# EAGLE design DmxAnalogLed (EAGLE 6.4)
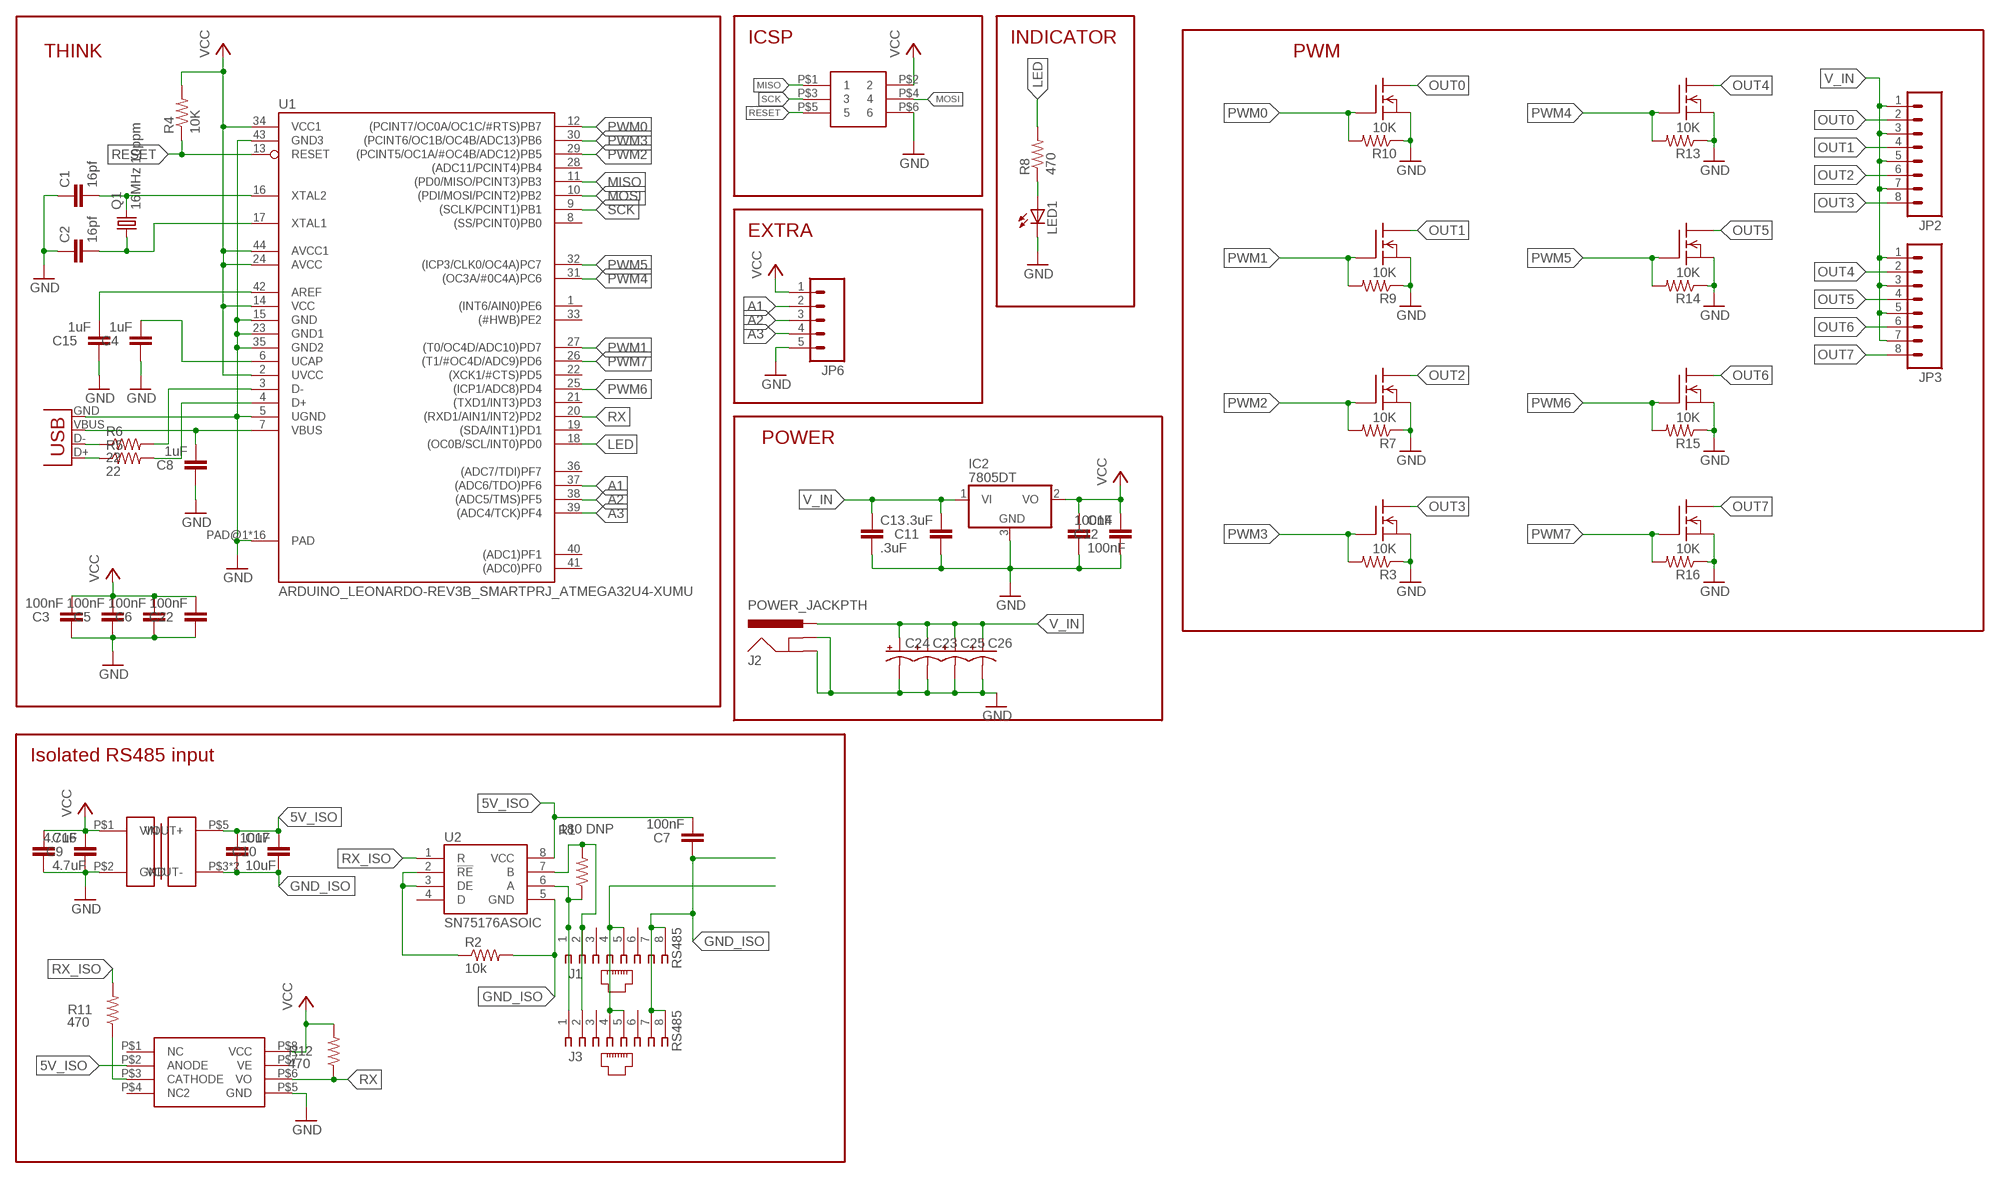
[diagram p0: schematic, sheet 1]

## Parts
C1  16pf  CAP0805  [0805]
C2  16pf  CAP0805  [0805]
C3  100nF  CAP0805  [0805]
C4  1uF  CAP0805  [0805]
C5  100nF  CAP0805  [0805]
C6  100nF  CAP0805  [0805]
C7  100nF  CAP0805  [0805]
C8  1uF  CAP0805  [0805]
C9  4.7uF  CAP0805  [0805]
C10  10uF  CAP0805  [0805]
C11  .3uF  CAP0805  [0805]
C12  100nF  CAP0805  [0805]
C13  .3uF  CAP1210  [1210]
C14  100nF  CAP1210  [1210]
C15  1uF  CAP0805  [0805]
C16  4.7uF  CAP1210  [1210]
C17  10uF  CAP1210  [1210]
C22  100nF  CAP0805  [0805]
C23  CAP_POLE  [PANASONIC_E]
C24  CAP_POLE  [PANASONIC_E]
C25  CAP_POLE  [PANASONIC_E]
C26  CAP_POLE  [PANASONIC_E]
IC2  7805DT  [TO252]
J1  RS485  520426-4  [520426-4]
J2  POWER_JACKPTH  [POWER_JACK_PTH]
J3  RS485  520426-4  [520426-4]
JP2  M083.5MM-8  [SCREWTERMINAL-3.5MM-8]
JP3  M083.5MM-8  [SCREWTERMINAL-3.5MM-8]
JP6  M05PTH  [1X05]
LED1  LED5MM  [LED5MM]
Q1  16MHz 10ppm  CRYSTAL  [XS3225]
R1  180 DNP  RESISTOR  [0805]
R2  10k  RESISTOR  [0805]
R3  10K  RESISTOR  [0805]
R4  10K  RESISTOR  [0805]
R5  22  RESISTOR  [0805]
R6  22  RESISTOR  [0805]
R7  10K  RESISTOR  [0805]
R8  470  RESISTOR  [0805]
R9  10K  RESISTOR  [0805]
R10  10K  RESISTOR  [0805]
R11  470  RESISTOR  [0805]
R12  470  RESISTOR  [0805]
R13  10K  RESISTOR  [0805]
R14  10K  RESISTOR  [0805]
R15  10K  RESISTOR  [0805]
R16  10K  RESISTOR  [0805]
U1  ARDUINO_LEONARDO-REV3B_SMARTPRJ_ATMEGA32U4-XUMU  [ARDUINO_LEONARDO-REV3B_SMARTPRJ_QFN44ML7X7]
U2  SN75176ASOIC  [SO08]
U$1  N_MOSFET  [TO252]
U$2  2X3HEADER  [2X3HEADER]
U$3  N_MOSFET  [TO252]
U$4  N_MOSFET  [TO252]
U$5  N_MOSFET  [TO252]
U$6  N_MOSFET  [TO252]
U$7  N_MOSFET  [TO252]
U$8  N_MOSFET  [TO252]
U$9  N_MOSFET  [TO252]
U$10  DC_DC_ISOLATED_0505  [IB_XLS-1W]
U$12  6N137  [8_SOIC]
X1  USBPTH  [USB-B-PTH]

## Nets
5V_ISO [power]: C7.2 C10.2 C17.1 U2.8(VCC) U$10.P$5(VOUT+) U$12.P$2(ANODE)
A1: JP6.2 U1.37((ADC6/TDO)PF6)
A2: JP6.3 U1.38((ADC5/TMS)PF5)
A3: JP6.4 U1.39((ADC4/TCK)PF4)
CONNECT_ME: R2.1 U2.2(!RE) U2.3(DE)
GND [power]: C1.1 C2.1 C3.1 C4.1 C5.1 C6.1 C8.1 C9.1 C11.1 C12.1 C13.2 C14.2 C15.1 C16.2 C22.1 C23.- C24.- C25.- C26.- IC2.3(GND) J2.GND J2.GNDBREAK JP6.5 LED1.K(C) R3.1 R7.1 R9.1 R10.1 R13.1 R14.1 R15.1 R16.1 U1.5(UGND) U1.15(GND) U1.23(GND1) U1.35(GND2) U1.43(GND3) U1.PAD@1(PAD) U1.PAD@2(PAD) U1.PAD@3(PAD) U1.PAD@4(PAD) U1.PAD@5(PAD) U1.PAD@6(PAD) U1.PAD@7(PAD) U1.PAD@8(PAD) U1.PAD@9(PAD) U1.PAD@10(PAD) U1.PAD@11(PAD) U1.PAD@12(PAD) U1.PAD@13(PAD) U1.PAD@14(PAD) U1.PAD@15(PAD) U1.PAD@16(PAD) U$1.P$2(S) U$2.P$6 U$3.P$2(S) U$4.P$2(S) U$5.P$2(S) U$6.P$2(S) U$7.P$2(S) U$8.P$2(S) U$9.P$2(S) U$10.P$2(GND) U$12.P$5(GND) X1.GND
GND_ISO [power]: C7.1 C10.1 C17.2 J1.7 J1.8 J3.7 J3.8 R2.2 U2.5(GND) U$10.P$3(VOUT-) U$10.P$4(VOUT-)
LED: R8.2 U1.18((OC0B/SCL/INT0)PD0)
MISO: U1.11((PD0/MISO/PCINT3)PB3) U$2.P$1
MOSI: U1.10((PDI/MOSI/PCINT2)PB2) U$2.P$4
N$1: R6.1 X1.D-
N$2: C1.2 Q1.P$3 U1.16(XTAL2)
N$3: R5.1 X1.D+
N$4: R5.2 U1.4(D+)
N$5: C2.2 Q1.P$1 U1.17(XTAL1)
N$6: R6.2 U1.3(D-)
N$8: LED1.A R8.1
N$9: C4.2 U1.6(UCAP)
N$10: C8.2 U1.7(VBUS) X1.VBUS
N$11: C15.2 U1.42(AREF)
N$14: R11.1 U$12.P$3(CATHODE)
OUT0: JP2.2 U$1.P$3(D)
OUT1: JP2.4 U$3.P$3(D)
OUT2: JP2.6 U$4.P$3(D)
OUT3: JP2.8 U$5.P$3(D)
OUT4: JP3.2 U$6.P$3(D)
OUT5: JP3.4 U$7.P$3(D)
OUT6: JP3.6 U$8.P$3(D)
OUT7: JP3.8 U$9.P$3(D)
PWM0: R10.2 U1.12((PCINT7/OC0A/OC1C/#RTS)PB7) U$1.P$1(G)
PWM1: R9.2 U1.27((T0/OC4D/ADC10)PD7) U$3.P$1(G)
PWM2: R7.2 U1.29((PCINT5/OC1A/#OC4B/ADC12)PB5) U$4.P$1(G)
PWM3: R3.2 U1.30((PCINT6/OC1B/OC4B/ADC13)PB6) U$5.P$1(G)
PWM4: R13.2 U1.31((OC3A/#0C4A)PC6) U$6.P$1(G)
PWM5: R14.2 U1.32((ICP3/CLK0/OC4A)PC7) U$7.P$1(G)
PWM6: R15.2 U1.25((ICP1/ADC8)PD4) U$8.P$1(G)
PWM7: R16.2 U1.26((T1/#OC4D/ADC9)PD6) U$9.P$1(G)
RESET: R4.1 U1.13(RESET) U$2.P$5
RS485A: J1.1 J3.1 R1.1 U2.6(A)
RS485B: J1.2 J3.2 R1.2 U2.7(B)
RX: R12.1 U1.20((RXD1/AIN1/INT2)PD2) U$12.P$6(VO)
RX_ISO: R11.2 U2.1(R)
SCK: U1.9((SCLK/PCINT1)PB1) U$2.P$3
V_IN [power]: C11.2 C13.1 C23.+ C24.+ C25.+ C26.+ IC2.1(VI) J2.PWR JP2.1 JP2.3 JP2.5 JP2.7 JP3.1 JP3.3 JP3.5 JP3.7
VCC: C3.2 C5.2 C6.2 C9.2 C12.2 C14.1 C16.1 C22.2 IC2.2(VO) JP6.1 R4.2 R12.2 U1.2(UVCC) U1.14(VCC) U1.24(AVCC) U1.34(VCC1) U1.44(AVCC1) U$2.P$2 U$10.P$1(VIN) U$12.P$8(VCC)
VMOT: J1.4 J1.5 J3.4 J3.5
Unconnected: J1.3 J1.6 J3.3 J3.6 U1.1((INT6/AIN0)PE6) U1.8((SS/PCINT0)PB0) U1.19((SDA/INT1)PD1) U1.21((TXD1/INT3)PD3) U1.22((XCK1/#CTS)PD5) U1.28((ADC11/PCINT4)PB4) U1.33((#HWB)PE2) U1.36((ADC7/TDI)PF7) U1.40((ADC1)PF1) U1.41((ADC0)PF0) U2.4(D) U$12.P$1(NC) U$12.P$4(NC2) U$12.P$7(VE)

## Notes on the sheet
- ICSP | INDICATOR
- THINK | PWM
- EXTRA
- POWER
- Isolated RS485 input

## Library data of the parts
C1-C17 C22 = SparkFun:CAP: Capacitor Standard 0603 ceramic capacitor, and 0.1" leaded capacitor.
C23-C26 = SparkFun:CAP_POL: Capacitor Polarized These are standard SMD and PTH capacitors. Normally 10uF, 47uF, and 100uF in electrolytic and tantalum varieties. Always verify the external diameter of the through hole cap, it varies with capacity, voltage, and manufacturer. The EIA devices should be standard.
IC2 = linear:78*: Positive VOLTAGE REGULATOR Source: http://cache.national.com/ds/LM/LM78L05.pdf http://www.fairchildsemi.com/ds/LM/LM7805.pdf
J1 J3 = con-amp:520426-4: AMP connector
J2 = SparkFun:POWER_JACK: Power Jack This is the standard 5.5mm barrel jack for power. The PTH is the most common, proven, reliable, footprint. All others are experimental. The Slot footprint only works if the mill layer is transmitted to the PCB fab house so be warned. Spark Fun Electronics SKU : PRT-00119. Mating wall wart : TOL-00298 (and others)
JP2 JP3 = SparkFun:M08: Header 8 Standard 8-pin 0.1" header. Use with straight break away headers (SKU : PRT-00116), right angle break away headers (PRT-00553), swiss pins (PRT-00743), machine pins (PRT-00117), and female headers (PRT-00115).
JP6 = SparkFun:M05: Header 5 Standard 5-pin 0.1" header. Use with straight break away headers (SKU : PRT-00116), right angle break away headers (PRT-00553), swiss pins (PRT-00743), machine pins (PRT-00117), and female headers (PRT-00115). Molex polarized connector foot print use with SKU : PRT-08230 with associated crimp pins and housings.
LED1 = SparkFun:LED: LEDs Standard schematic elements and footprints for 5mm, 3mm, 1206, and 0603 sized LEDs. 5mm - Spark Fun Electronics SKU : COM-00529 (and others)
Q1 = blinkyboard:CRYSTAL: CRYSTAL
R1-R16 = SparkFun:RESISTOR: Resistor Basic schematic elements and footprints for 0603, 1206, and PTH 1/10th watt (small) resistors.
U1 = blinkiverse:ARDUINO_LEONARDO-REV3B_SMARTPRJ_ATMEGA32U4-XU
U2 = reprap:SN75176A
U$1 U$3-U$9 = blinkiverse:N_MOSFET
U$2 = sonos_library:2X3HEADER
U$10 = blinkiverse:DC_DC_ISOLATED_0505: Galvanicly isolated 5v:5v converter. Could be a
U$12 = sonos_library:6N137
X1 = SparkFun:USB: USB Connectors USB-B-PTH is fully proven SKU : PRT-00139 USB-miniB is fully proven SKU : PRT-00587 USB-A-PCB is untested. USB-A-H is throughly reviewed, but untested. Spark Fun Electronics SKU : PRT-00437 USB-B-SMT is throughly reviewed, but untested. Needs silkscreen touching up. USB-A-S has not been used/tested USB-MB-H has not been used/tested

## Net classes
0 default: width 0.254 mm
1 power: width 0.406 mm
2 motors: width 0.61 mm

## Board
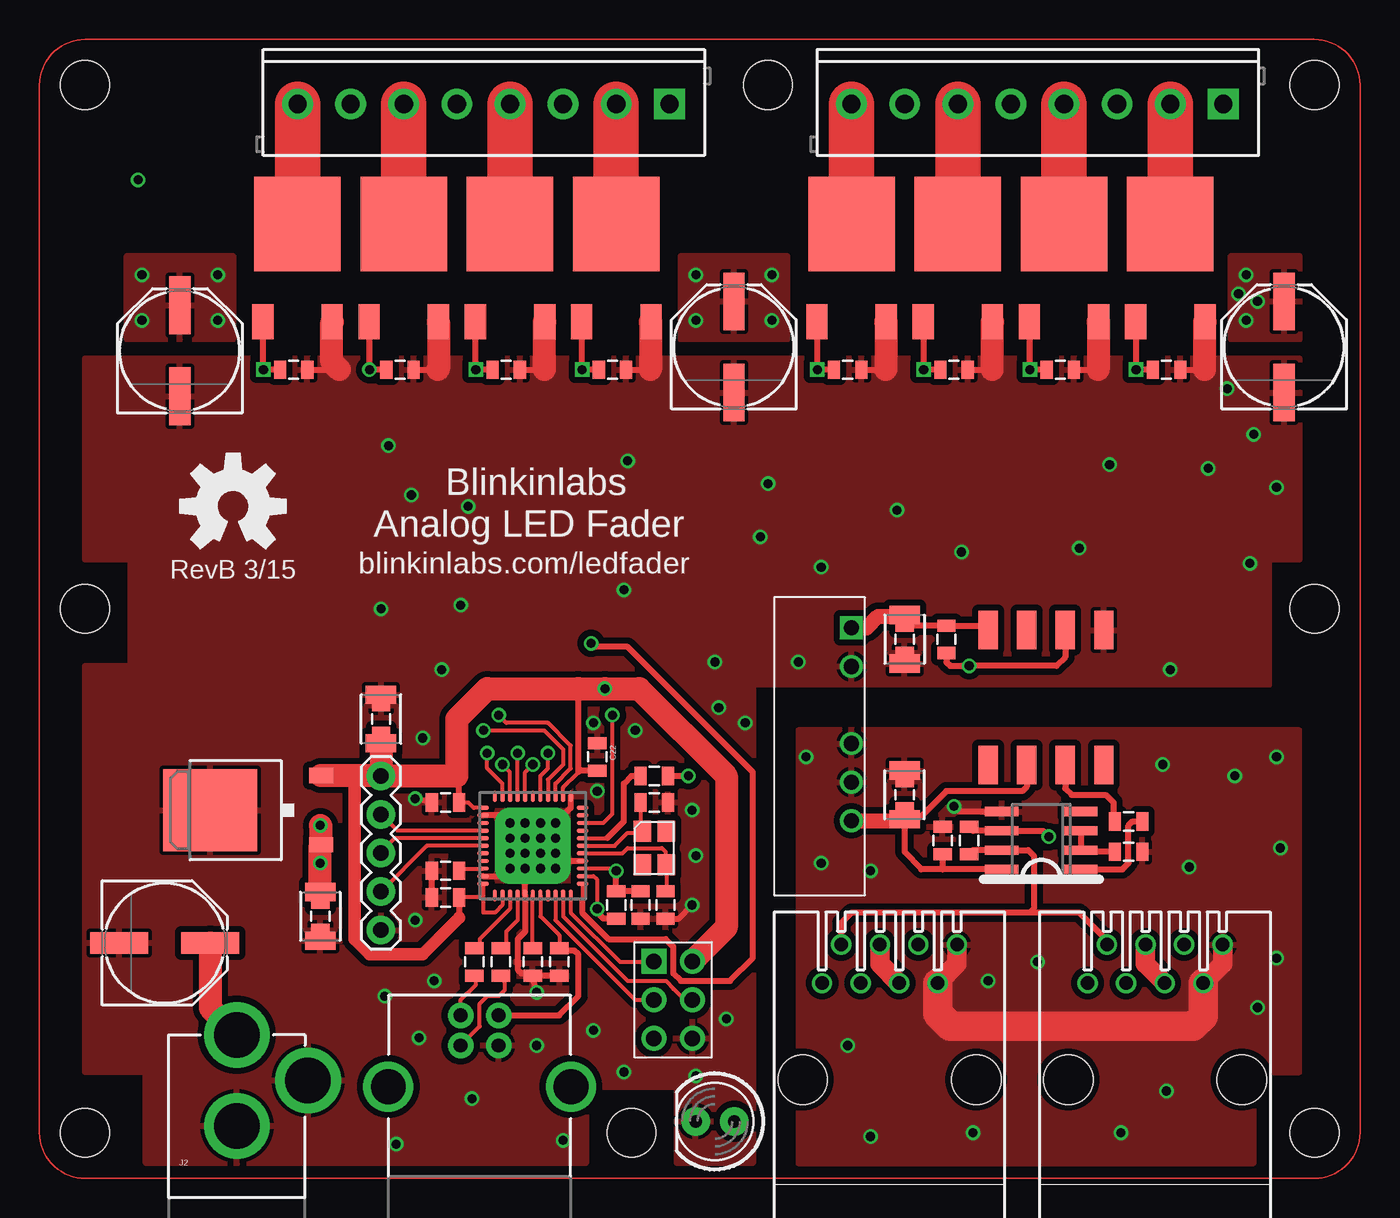
[diagram p1: board, top side]
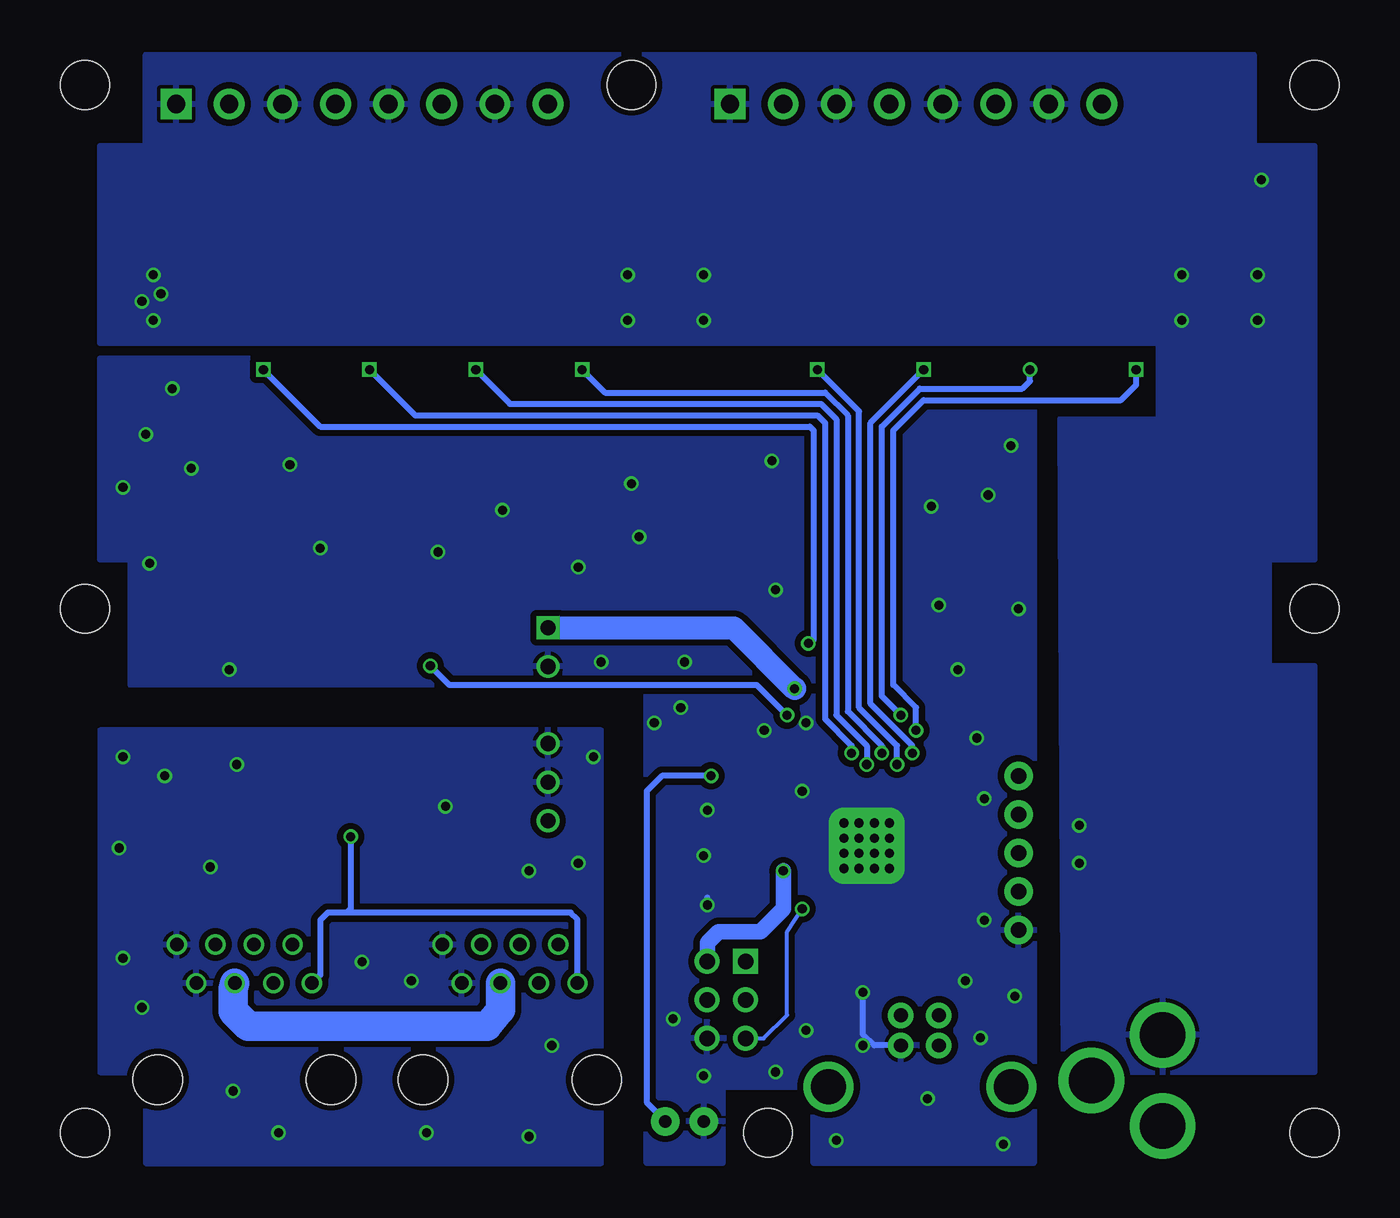
[diagram p2: board, bottom side, seen from below]

No outline drawn. Coordinates in mm, seen from the top.
Copper layers (1*16): Top 0.0356mm / dielectric 1.5011mm / Bottom 0.0356mm
Design rules "default": minimum track width 6mil, minimum drill 13mil, track to track 6mil, track to pad 6mil, pad to pad 6mil, via to via 6mil, smd to smd 6mil, copper to edge 15mil, drill to drill 6mil, minimum pad ring 7mil, minimum via ring 7mil, stop-mask expansion 4mil, vias tented up to drill 0.5mm, thermal gap 10mil
Holes 3.2 mm at 84,3 84,72 3,72 3,3 39,3 3,37.5 84,37.5 48,72

### Footprints (pad centres in the part's own frame; a part is rotated, then mirrored left to right if it is on the bottom)
0805 = smd 0.8 x 1.2: 1 -0.9,0; 2 0.9,0
1210 = smd 1.2 x 2: 1 -1.6,0; 2 1.6,0
PANASONIC_E = smd 3.8 x 1.4: + 3,0; - -3,0
TO252 = smd 1 x 1.6: 1 -2.28,-4.8; 2 2.28,-4.8 | smd 5.4 x 6.2: 3 0,2.5
520426-4 = drill 0.889: 1 -4.445,6.35; 2 -3.175,8.89; 3 -1.905,6.35; 4 -0.635,8.89; 5 0.635,6.35; 6 1.905,8.89; 7 3.175,6.35; 8 4.445,8.89 | hole 3.251: -5.715,0; 5.715,0
POWER_JACK_PTH = drill 2.997 pad 4.318: GND 0,7.7; GNDBREAK 4.7,10.7; PWR 0,13.7
SCREWTERMINAL-3.5MM-8 = drill 1.2 pad 2.032 square: 1 0,0 | drill 1.2 pad 2.032: 2 3.5,0; 3 7,0; 4 10.5,0; 5 14,0; 6 17.5,0; 7 21,0; 8 24.5,0
1X05 = drill 1.016 pad 1.88: 1 0,0; 2 2.54,0; 3 5.08,0; 4 7.62,0; 5 10.16,0
LED5MM = drill 0.813 pad 1.88: A -1.27,0; K 1.27,0
XS3225 = smd 1.4 x 1.15: P$1 -1.1,-0.8; P$2 1.1,-0.8; P$3 1.1,0.8; P$4 -1.1,0.8
ARDUINO_LEONARDO-REV3B_SMARTPRJ_QFN44ML7X7 = smd 0.75 x 0.275: 1 -3.275,2.5; 2 -3.275,2; 3 -3.275,1.5; 4 -3.275,1; 5 -3.275,0.5; 6 -3.275,0; 7 -3.275,-0.5; 8 -3.275,-1; 9 -3.275,-1.5; 10 -3.275,-2; 11 -3.275,-2.5; 23 3.275,-2.5; 24 3.275,-2; 25 3.275,-1.5; 26 3.275,-1; 27 3.275,-0.5; 28 3.275,0; 29 3.275,0.5; 30 3.275,1; 31 3.275,1.5; 32 3.275,2; 33 3.275,2.5 | smd 0.275 x 0.75: 12 -2.5,-3.275; 13 -2,-3.275; 14 -1.5,-3.275; 15 -1,-3.275; 16 -0.5,-3.275; 17 0,-3.275; 18 0.5,-3.275; 19 1,-3.275; 20 1.5,-3.275; 21 2,-3.275; 22 2.5,-3.275; 34 2.5,3.275; 35 2,3.275; 36 1.5,3.275; 37 1,3.275; 38 0.5,3.275; 39 0,3.275; 40 -0.5,3.275; 41 -1,3.275; 42 -1.5,3.275; 43 -2,3.275; 44 -2.5,3.275 | drill 0.6 pad 2: PAD@1 -1.5,1.5; PAD@4 1.5,1.5; PAD@13 -1.5,-1.5; PAD@16 1.5,-1.5 | drill 0.6 pad 2 square: PAD@2 -0.5,1.5; PAD@3 0.5,1.5; PAD@5 -1.5,0.5; PAD@8 1.5,0.5; PAD@9 -1.5,-0.5; PAD@12 1.5,-0.5; PAD@14 -0.5,-1.5; PAD@15 0.5,-1.5 | drill 0.6 pad 1 square: PAD@6 -0.5,0.5; PAD@7 0.5,0.5; PAD@10 -0.5,-0.5; PAD@11 0.5,-0.5
SO08 = smd 0.6 x 2.2: 1 -1.905,-2.6; 2 -0.635,-2.6; 3 0.635,-2.6; 4 1.905,-2.6; 5 1.905,2.6; 6 0.635,2.6; 7 -0.635,2.6; 8 -1.905,2.6
TO252' = smd 1.4 x 2.3: P$1 -2.285,-3.35; P$2 2.285,-3.35 | smd 5.7 x 6.2: P$3 0,3.1
2X3HEADER = drill 1.016 pad 1.651 square: P$1 -1.27,2.54 | drill 1.016 pad 1.651: P$2 1.27,2.54; P$3 -1.27,0; P$4 1.27,0; P$5 -1.27,-2.54; P$6 1.27,-2.54
IB_XLS-1W = drill 1 square: P$1 0,0 | drill 1: P$2 2.54,0; P$3 7.62,0; P$4 10.16,0; P$5 12.7,0
8_SOIC = smd 1.27 x 2.54: P$1 0,-2.54; P$2 2.54,-2.54; P$3 5.08,-2.54; P$4 7.62,-2.54; P$5 7.62,6.35; P$6 5.08,6.35; P$7 2.54,6.35; P$8 0,6.35
USB-B-PTH = drill 0.914 pad 1.676: D+ 0,1.25; D- 1.981,1.25; GND 0,-1.25; VBUS 1.981,-1.25 | drill 2.286: S1 -2.718,-6.02; S2 -2.718,6.02

### Placement (x,y rotation side)
C1  41.25,18 90 top
C2  40.5,24.75 180 top
C3  26.75,18.5 0 top
C4  32.5,14.25 90 top
C5  26.75,24.75 0 top
C6  39.6,18 90 top
C7  59.5,22.25 270 top
C8  34.25,14.25 90 top
C9  57,35.5 90 top
C10  57,25.25 270 top
C11  18.5,17.25 90 top
C12  22.5,30.25 270 top
C13  18.5,17.25 270 top
C14  22.5,30.25 90 top
C15  26.75,20.25 0 top
C16  57,35.5 270 top
C17  57,25.25 90 top
C22  36.75,27.75 270 top
C23  45.75,54.75 90 top
C24  82,54.75 90 top
C25  9.25,54.5 90 top
C26  8.25,15.5 0 top
IC2  13.75,24.25 90 top
J1  56,6.5 0 top
J2  13,-4.25 0 top
J3  73.5,6.5 0 top
JP2  78,70.75 180 top
JP3  41.5,70.75 180 top
JP6  22.5,26.5 270 top
LED1  44.5,3.75 180 top
Q1  40.5,21.75 270 top
R1  61.25,22.25 270 top
R2  71.75,21.5 0 top
R3  53.25,53.25 180 top
R4  38,18 90 top
R5  30.4,14.25 90 top
R6  28.65,14.25 90 top
R7  60.25,53.25 180 top
R8  40.5,26.5 180 top
R9  67.25,53.25 180 top
R10  74.25,53.25 180 top
R11  71.75,23.5 0 top
R12  59.75,35.5 90 top
R13  37.75,53.25 180 top
R14  30.75,53.25 180 top
R15  23.75,53.25 180 top
R16  16.75,53.25 180 top
U1  32.5,21.9 90 top
U2  66,22.25 90 top
U$1  N_MOSFET  [TO252']  74.5,59.75 0 top
U$2  41.75,11.75 0 top
U$3  N_MOSFET  [TO252']  67.5,59.75 0 top
U$4  N_MOSFET  [TO252']  60.5,59.75 0 top
U$5  N_MOSFET  [TO252']  53.5,59.75 0 top
U$6  N_MOSFET  [TO252']  38,59.75 0 top
U$7  N_MOSFET  [TO252']  31,59.75 0 top
U$8  N_MOSFET  [TO252']  24,59.75 0 top
U$9  N_MOSFET  [TO252']  17,59.75 0 top
U$10  53.5,36.25 270 top
U$12  62.5,29.75 0 top
U$13  [OSHW-LOGO-L]  12.75,44.25 0 top
X1  29,8.75 90 top

### Tracks (layer width: path | path; a pad name or v marks a point on that pad's centre or on a via)
5V_ISO
  Top 0.406: U$12.P$2 65.04,25.79 64.75,25.5 59.75,25.5 58,23.75 57.1,23.75 C17.1 | C10.2 C17.1 | C17.1 57,21.5 58.09,20.34 59.5,20.34 | U2.8 59.5,20.34 | C7.2 59.5,20.34
  Top 1: U$10.P$5 56.9,23.55 C17.1
A1
  Top 0.254: JP6.2 22.54,23.96 23.6,22.9 U1.37
A2
  Top 0.254: U1.38 23.4,22.4 22.5,21.5 22.58,21.5 JP6.3
A3
  Top 0.254: U1.39 25.52,21.9 JP6.4
CONNECT_ME
  Top 0.406: U2.3 U2.2 68.72,21.5 R2.1
GND  (via drill 0.6)
  Top 0.406: C8.1 C4.1 | C4.1 32.35,13.5 31.75,13.5 31.5,13.75 31.5,15.75 32,16.25 U1.5 U1.PAD@5 | v32.75,12.25 C4.1 | U1.PAD@5 U1.PAD@9 U1.PAD@10 | U1.PAD@10 U1.PAD@6 U1.PAD@2 U1.PAD@3 | 34.5,20.9 U1.PAD@14 U1.PAD@15 | 34.5,20.9 U1.15 | U1.35 30.5,23.9 U1.PAD@4 U1.PAD@8 U1.PAD@12 U1.PAD@16 | U1.23 35,24.4 U1.PAD@16 | U1.PAD@11 U1.PAD@15 | 34.5,20.9 U1.PAD@13 | U1.PAD@11 U1.PAD@10 | U1.PAD@7 U1.PAD@11 | U1.PAD@5 U1.PAD@1 30.5,19.9 U1.43 | C5.1 v24.75,25 | C15.1 C3.1 | U1.PAD@16 U1.PAD@15 | R16.1 19.75,53.25 | R15.1 26.25,53.25 | R14.1 33.25,53.25 | R13.1 40.25,53.25 | R3.1 55.75,53.25 | R7.1 62.75,53.25 | R9.1 69.75,53.25 | R10.1 76.75,53.25 | C1.1 42.1,17.1 v43,18
  Top 1.5: 19.75,53.25 19.25,53.75 19.25,56.37 U$9.P$2 | U$8.P$2 26.29,53.28 26.25,53.25 | U$7.P$2 33.25,56.4 33.25,53.25 | 40.25,56.4 U$6.P$2 40.25,56.37 40.25,53.25 | U$5.P$2 55.75,56.4 55.75,53.25 | U$4.P$2 62.75,56.4 62.75,53.25 | U$3.P$2 69.75,56.4 69.75,53.25 | U$1.P$2 76.75,56.4 76.75,53.25
  Bottom 0.406: X1.GND 32,8.75 32.75,9.5 v32.75,12.25 | 34.1,22.5 U1.PAD@15 | v43,18 43,18.5
  other vias: 43,24.25 43.25,21.25 22.5,37.5 27.75,37.75 24.5,45 28.25,44.25 23,48.25 38.75,47.25 38.5,38.75 74.5,33.5 48,45.75 44.5,34 68.5,41.5 81.5,45.5 56.5,44 79.75,40.5 60.75,41.25 70.5,47 77,46.75 46.5,30 44.75,31 25.25,29 26.5,33.5 26,13 22.75,12 25,9.25 23.5,2.25 28.5,5.25 36.5,9.75 32.75,8.75 45.25,10.5 43.25,6.75 38.5,7 34.5,2.5 36.75,25.5 39.25,29.5 24.75,17 50,34 51.5,40.25 47.5,42.25 36.5,30 78.25,52 80,49
  pour Top (isolate 0.406): 47,1 42,1 42,6 36,6 36,1 7,1 7,7 3,7 3,33.75 6,33.75 6,40.75 3,40.75 3,54 83,54 83,40.75 81,40.75 81,32.5 47,32.5
  pour Bottom (isolate 0.406): 47,1 47,32.5 81,32.5 81,40.75 83,40.75 83,54 21.5,54 21.5,1 36,1 36,6 42,6 42,1
GND_ISO  (via drill 0.6)
  Top 0.406: U2.5 60.59,24.16 v60.25,24.5
  Top 1.27: J3.8 77.94,14.12 J3.7 | J1.8 60.45,14.12 J1.7
  Top 1.93: J1.7 59.17,10.82 60,10 76,10 76.67,10.68 J3.7
  other vias: 54.75,20.25 51.5,20.75 50.5,27.75 81.5,27.75 78.75,26.5 74,27.25 75.75,20.5 81.75,21.75 81.5,14.5 80.25,11.25 74.25,5.75 53.25,8.75 54.75,2.75 61.5,3 71.25,3 65.75,14.25 62.5,13
  pour Top (isolate 0.406): 50,29.5 50,1 80,1 80,7 83,7 83,29.5
  pour Bottom (isolate 0.406): 50,29.5 83,29.5 83,7 80,7 80,1 50,1
LED
  Top 0.254: R8.2 39.5,26.5 | U1.18 37.4,22.4
  Top 0.406: 37.4,22.4 38.5,23.5 38.5,26 39,26.5 R8.2
MISO
  Top 0.254: U1.11 35,17.5 38.25,14.25 40.44,14.25 U$2.P$1
MOSI
  Top 0.254: U1.10 34.5,17.25 38.75,13 41.27,13 41.77,12.48 42.5,11.75 U$2.P$4
N$1
  Top 0.254: X1.D- 27.75,11.75 28.75,12.75 28.75,13.2 arc-90 R6.1
N$2
  Top 0.254: U1.16 38.4,21.4 38.75,21.75 41,21.75 41.25,21.5 41.25,20.7 Q1.P$3 41.3,18.95 C1.2
N$3
  Top 0.254: X1.D+ 29,10 29,11.5 29.5,12 30.25,12 30.65,12.4 30.65,12.9 R5.1
N$4
  Top 0.254: U1.4 31.5,17 30.75,16.25 30.75,15.25 R5.2
N$5
  Top 0.254: U1.17 37.9,21.9 38.75,22.75 39.6,22.75 Q1.P$1 39.6,22.95 C2.2
N$6
  Top 0.254: U1.3 31,17.75 29,15.75 29,15.25 R6.2
N$7
  Top 0.1: 84,0 3,0 arc-90 0,3 0,72 arc-90 3,75 84,75 arc-90 87,72 87,3 arc-90 84,0
N$8  (via drill 0.6)
  Top 0.406: R8.1 v42.75,26.5
  Bottom 0.406: v42.75,26.5 46,26.5 47,25.5 47,5.02 45.75,3.77 LED1.A
N$9
  Top 0.254: C4.2 U1.6
N$10
  Top 0.254: U1.7 33,17.25 34.25,16 C8.2 34.65,15
  Top 0.406: X1.VBUS 34.23,10.73 35.5,12 35.5,14.75 35.25,15 34.65,15
N$11
  Top 0.254: C15.2 27.8,20.4 U1.42
N$14
  Top 0.406: U$12.P$3 67.58,25.67 68,25.25 70.25,25.25 70.75,24.75 70.75,23.1 R11.1
OUT0
  Top 3: U$1.P$3 JP2.2
OUT1
  Top 3: U$3.P$3 JP2.4
OUT2
  Top 3: U$4.P$3 JP2.6
OUT3
  Top 3: U$5.P$3 JP2.8
OUT4
  Top 3: U$6.P$3 JP3.2
OUT5
  Top 3: U$7.P$3 JP3.4
OUT6
  Top 3: U$8.P$3 JP3.6
OUT7
  Top 3: U$9.P$3 JP3.8
PWM0  (via drill 0.6)
  Top 0.254: U1.12 35.77,18.27 35.75,18.25
  Top 0.406: U$1.P$1 72.25,56.37 v72.25,53.25 R10.2 | 35.75,18.25 35.75,17.5 37.5,15.75 41.25,15.75 41.75,15.25 41.75,13.5 42.25,13 45.5,13 47,14.5 47,26.75 38.75,35 36.58,35 v36.35,35.23
  Bottom 0.406: v72.25,53.25 68.5,49.5 36.25,49.5 36,49.25 36,35.5 36.27,35.23 v36.35,35.23
PWM1  (via drill 0.6)
  Top 0.254: U1.27 33,26.5 33.5,27 v33.5,28
  Top 0.406: U$3.P$1 65.25,56.37 v65.25,53.25 R9.2
  Bottom 0.406: v65.25,53.25 62.25,50.25 35.75,50.25 35.25,49.75 35.25,30.25 33.5,28.5 v33.5,28
PWM2  (via drill 0.6)
  Top 0.254: U1.29 32,26.75 v32.5,27.25 | 58.25,56.37 U$4.P$1
  Top 0.406: 58.25,56.37 v58.25,53.25 R7.2
  Bottom 0.406: v58.25,53.25 56,51 35.5,51 34.5,50 34.5,30.5 32.5,28.5 v32.5,27.25
PWM3  (via drill 0.6)
  Top 0.254: U1.30 v31.5,28
  Top 0.406: U$5.P$1 51.22,53.25 v51.25,53.25 R3.2
  Bottom 0.406: v51.25,53.25 49.75,51.75 35.25,51.75 33.75,50.25 33.75,30.75 31.5,28.5 v31.5,28
PWM4  (via drill 0.6)
  Top 0.254: U1.31 31,26.75 v30.5,27.25
  Top 0.406: U$6.P$1 35.72,53.28 v35.75,53.25 R13.2
  Bottom 0.406: v30.5,27.25 30.5,28.5 33,31 33,50.5 v35.75,53.25
PWM5  (via drill 0.6)
  Top 0.254: U1.32 30.5,26 29.5,27 v29.5,28
  Top 0.406: U$7.P$1 28.71,53.78 28.75,53.75 v28.75,53.25 R14.2
  Bottom 0.406: v29.5,28 29.5,28.5 32.25,31.25 32.25,49.75 v28.75,53.25
PWM6  (via drill 0.6)
  Top 0.254: U1.25 34,26 35,27 35,28.5 33.5,30 30.75,30 v30.25,30.5
  Top 0.406: U$8.P$1 21.75,56.37 v21.75,53.25 R15.2
  Bottom 0.406: v30.25,30.5 31.5,31.75 31.5,49.5 29,52 22.25,52 21.75,52.5 v21.75,53.25
PWM7  (via drill 0.6)
  Top 0.254: v29.25,29.5 33.25,29.5 34.5,28.25 34.5,27.25 33.5,26.25 U1.26
  Top 0.406: U$9.P$1 14.71,53.28 v14.75,53.25 R16.2
  Bottom 0.406: v29.25,29.5 29.25,31 30.75,32.5 30.75,49.25 28.75,51.25 15.75,51.25 14.75,52.25 v14.75,53.25
RESET  (via drill 0.6)
  Top 0.254: U1.13 36.5,19.9 36.75,19.65 v36.75,17.75
  Top 0.406: R4.1 37.15,17.1 36.75,17.5 v36.75,17.75
  Bottom 0.254: U$2.P$5 39.29,9.21 37.75,10.75 37.75,16.25 v36.75,17.75
RS485A  (via drill 0.6)
  Top 0.406: v66.5,22.5 66.11,22.89 U2.6 61.52,22.89 R1.1
  Bottom 0.406: J1.1 51.55,17.05 52,17.5 66.75,17.5 | 66.75,17.5 68,17.5 68.5,17 68.5,13.4 J3.1 | v66.5,22.5 66.5,17.75 66.75,17.5
RS485B
  Top 0.406: J1.2 52.83,16.82 53.5,17.5 65.25,17.5 | J3.2 70.33,15.68 68.5,17.5 65.25,17.5 | 65.25,17.5 65.5,17.75 65.5,21.25 65.14,21.61 U2.7 61.52,21.61 R1.2
RX  (via drill 0.6)
  Top 0.254: v37.75,30.5 37.75,24 37.15,23.4 U1.20
  Top 0.406: U$12.P$6 67.58,34.33 67,33.75 v61.25,33.75 60,33.75 59.75,34 R12.1
  Bottom 0.406: v37.75,30.5 39.75,32.5 60,32.5 v61.25,33.75
RX_ISO
  Top 0.406: U2.1 71.34,20.34 71.75,20.75 71.75,23.25 72,23.5 R11.2
SCK
  Top 0.254: U1.9 34,17 39.25,11.75 U$2.P$3
V_IN  (via drill 0.6)
  Top 0.406: 18.53,18.57 18.47,18.57 C11.2
  Top 0.813: C11.2 C13.1 v18.5,20.75 18.55,20.55
  Top 1.5: C26.+ 11.25,11.2 J2.PWR | v18.5,23.25 18.55,23.2 IC2.1 18.5,21.92 C13.1
  other vias: 11.75,56.5 6.75,56.5 11.75,59.5 6.75,59.5 6.5,65.75 48.25,56.5 43.25,56.5 48.25,59.5 43.25,59.5 79,58.25 79.5,56.5 80.25,57.75 79.5,59.5
  pour Bottom (isolate 0.406): 83,55 83,68 80,68 80,74 7,74 7,68 3,68 3,40.75 6,40.75 6,33.75 3,33.75 3,7 19.5,7 19.75,50 13.25,50 13.25,55
  pour Top (isolate 0.254): 12.75,55.25 5.75,55.25 5.75,60.75 12.75,60.75
  pour Top (isolate 0.254): 49.25,55.25 42.25,55.25 42.25,60.75 49.25,60.75
  pour Top (isolate 0.254): 83,55.25 78.5,55.25 78.5,60.75 83,60.75
VCC  (via drill 0.6)
  Top 0.254: U1.2 30.5,18 30,17.5 29.25,17.5 29.25,18.5 | 29.25,18.5 29.25,19.38 U1.44 | v38,20.25 37.85,20.4 U1.14 | C5.2 28.25,24.75 28.6,24.4 U1.34 | 29.25,18.5 C3.2 | U1.24 34.5,25.75 35.5,26.75
  Top 0.406: C3.2 27.65,17.15 | v38,20.25 R4.2 C6.2 | C12.2 C14.1 | 35.5,26.75 35.5,27 | 35.5,27 35.5,32.25 | C5.2 27.65,26.35 27.5,26.5 | U$12.P$8 62.2,36.4 R12.2 C9.2 C16.1 | C22.2 35.65,26.85 35.5,27
  Top 0.813: 27.65,17.15 25.25,14.75 21.75,14.75 20.75,15.75 20.75,26.5 JP6.1
  Top 1: U$10.P$1 54.5,36.25 55.25,37 56.9,37 C16.1
  Top 1.5: C14.1 JP6.1 | JP6.1 27.5,26.5 27.5,30.25 29.5,32.25 35.5,32.25 v37.25,32.25 39.5,32.25 45.25,26.5 45.25,16.52 U$2.P$2 | IC2.2 22.47,26.53 JP6.1
  Bottom 1.016: v38,20.25 38,17.75 39.5,16.25 42.25,16.25 43,15.5 43,14.31 U$2.P$2
  Bottom 1.5: U$10.P$1 41.25,36.25 v37.25,32.25
VMOT
  Top 1.27: J3.4 72.86,14.12 J3.5 | J1.4 55.37,14.12 J1.5
  Bottom 1.93: J1.5 56.63,11.12 57.5,10 73.25,10 74.25,11 74.25,12.48 J3.5

### Text on the board
tNames: Blinkinlabs | Analog LED Fader | RevB 3/15 | blinkinlabs.com/ledfader